# Altium project MU-RK3576J-MB.PrjPCB (part 2 of 13)

## Sheet PWR_PMIC.SchDoc
size 420 x 297 mm; Title1str: Модуль; PageSetup: Record=PageOptions|CenterHorizontal=False|CenterVertical=False|PrintScale=0.95|XCorrection=0.00|YCorrection=0.00|PrintKind=1|BorderSize=5000000|LeftOffset=0|BottomOffset=0|Orientation=1|PaperLength=1000|PaperWidth=1000|Scale=100|PaperSource=15|PrintQuality=600|MediaType=1|DitherType=10|PaperKind=A4|PrintScaleMode=1; Title2str: ATB-LW-USB-GateWay; Mass: ---; Letter1Column: О; Letter2Column: {L}; DocumentType1str: {Документ}; DocumentType2str: {Документ}; SpravNomer: {Справ. №}; Scale: 1:1; DocumentType: Схема электрическая принципиальная; SheetNumber: 7; SheetTotal: 32; DocumentTypeShort: Э3; DocumentInvertoryNumber: ㅤ
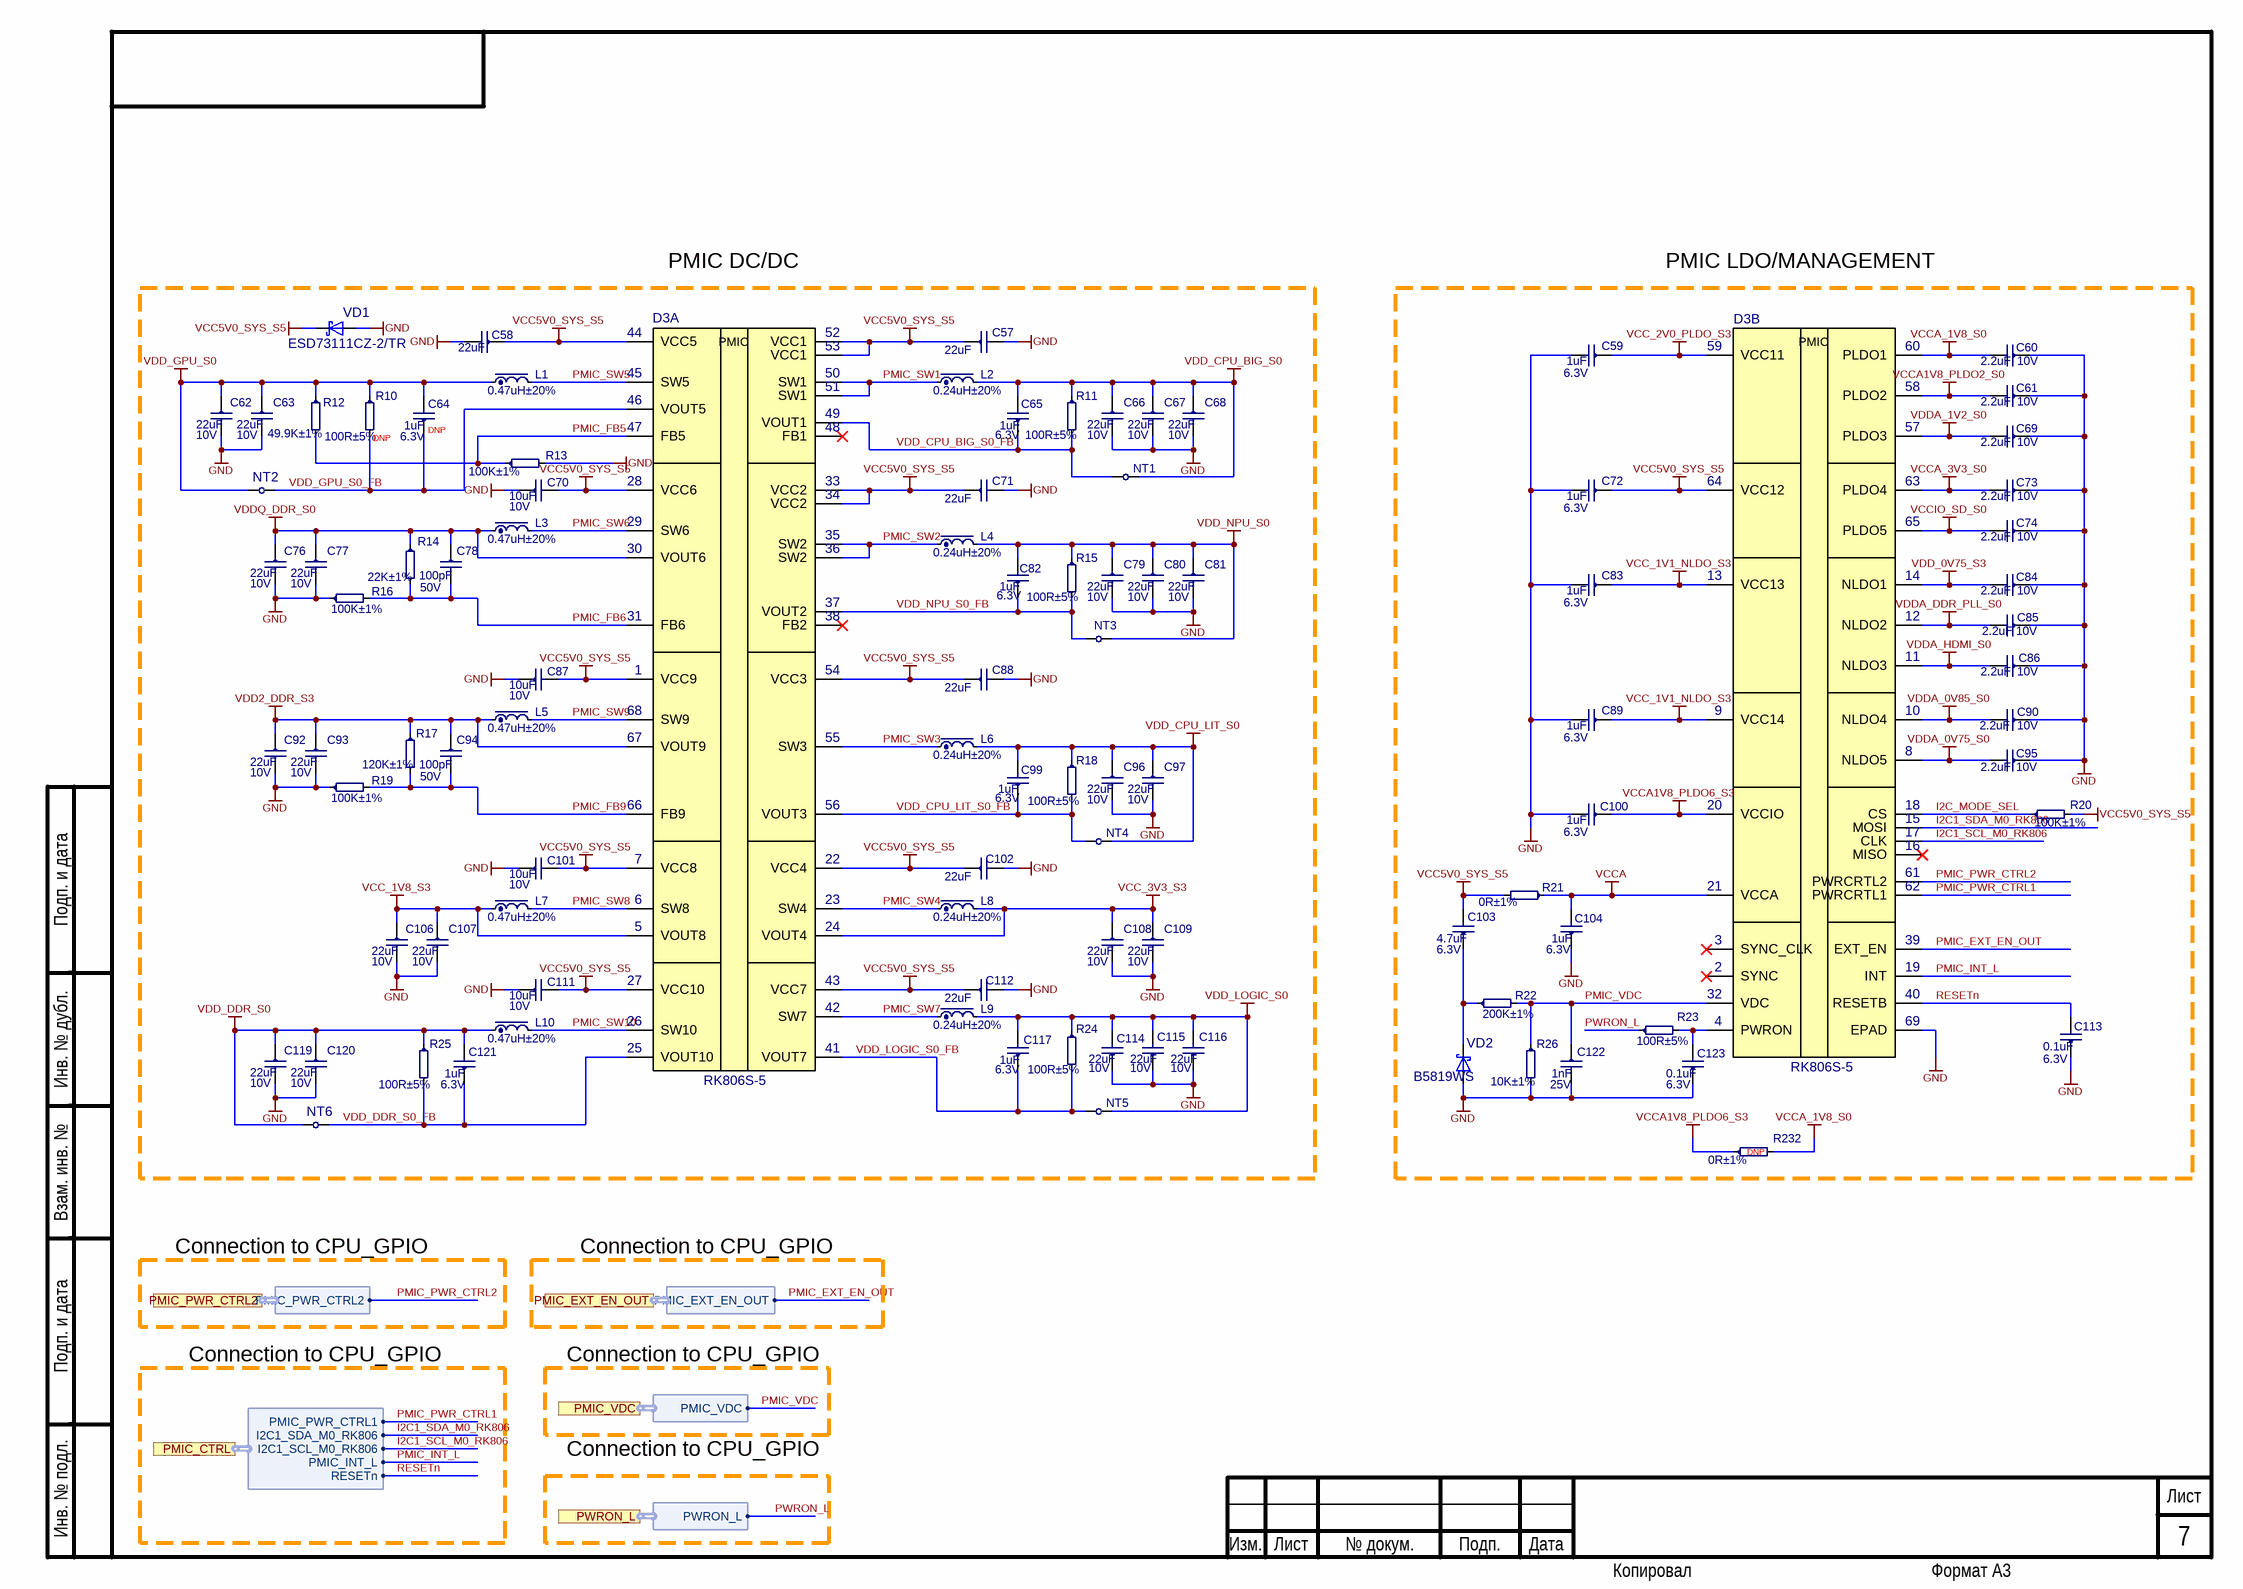
[diagram p4: PWR_PMIC.SchDoc]

### Parts
C57  22uF  [C0603]
C58  22uF  [C0603]
C59  1uF  Voltage: 6.3V  [C0201]
C60  2.2uF  Voltage: 10V  [C0402]
C61  2.2uF  Voltage: 10V  [C0402]
C62  22uF  Voltage: 10V  [C0603]
C63  22uF  Voltage: 10V  [C0603]
C64  1uF  Voltage: 6.3V  [C0201]
C65  1uF  Voltage: 6.3V  [C0201]
C66  22uF  Voltage: 10V  [C0603]
C67  22uF  Voltage: 10V  [C0603]
C68  22uF  Voltage: 10V  [C0603]
C69  2.2uF  Voltage: 10V  [C0402]
C70  10uF  Voltage: 10V  [C0603]
C71  22uF  [C0603]
C72  1uF  Voltage: 6.3V  [C0201]
C73  2.2uF  Voltage: 10V  [C0402]
C74  2.2uF  Voltage: 10V  [C0402]
C76  22uF  Voltage: 10V  [C0603]
C77  22uF  Voltage: 10V  [C0603]
C78  100pF  Voltage: 50V  [C0402]
C79  22uF  Voltage: 10V  [C0603]
C80  22uF  Voltage: 10V  [C0603]
C81  22uF  Voltage: 10V  [C0603]
C82  1uF  Voltage: 6.3V  [C0201]
C83  1uF  Voltage: 6.3V  [C0201]
C84  2.2uF  Voltage: 10V  [C0402]
C85  2.2uF  Voltage: 10V  [C0402]
C86  2.2uF  Voltage: 10V  [C0402]
C87  10uF  Voltage: 10V  [C0603]
C88  22uF  [C0603]
C89  1uF  Voltage: 6.3V  [C0201]
C90  2.2uF  Voltage: 10V  [C0402]
C92  22uF  Voltage: 10V  [C0603]
C93  22uF  Voltage: 10V  [C0603]
C94  100pF  Voltage: 50V  [C0402]
C95  2.2uF  Voltage: 10V  [C0402]
C96  22uF  Voltage: 10V  [C0603]
C97  22uF  Voltage: 10V  [C0603]
C99  1uF  Voltage: 6.3V  [C0201]
C100  1uF  Voltage: 6.3V  [C0201]
C101  10uF  Voltage: 10V  [C0603]
C102  22uF  [C0603]
C103  4.7uF  Voltage: 6.3V  [C0201]
C104  1uF  Voltage: 6.3V  [C0201]
C106  22uF  Voltage: 10V  [C0603]
C107  22uF  Voltage: 10V  [C0603]
C108  22uF  Voltage: 10V  [C0603]
C109  22uF  Voltage: 10V  [C0603]
C111  10uF  Voltage: 10V  [C0603]
C112  22uF  [C0603]
C113  0.1uF  Voltage: 6.3V  [C0201]
C114  22uF  Voltage: 10V  [C0603]
C115  22uF  Voltage: 10V  [C0603]
C116  22uF  Voltage: 10V  [C0603]
C117  1uF  Voltage: 6.3V  [C0201]
C119  22uF  Voltage: 10V  [C0603]
C120  22uF  Voltage: 10V  [C0603]
C121  1uF  Voltage: 6.3V  [C0201]
C122  1nF  Voltage: 25V  [C0201]
C123  0.1uF  Voltage: 6.3V  [C0201]
D3  RK806S-5  [RK806-1]  (parts A,B of 2)
L1  0.47uH±20%  [L0806]
L2  0.24uH±20%  [L0806]
L3  0.47uH±20%  [L0806]
L4  0.24uH±20%  [L0806]
L5  0.47uH±20%  [L0806]
L6  0.24uH±20%  [L0806]
L7  0.47uH±20%  [L0806]
L8  0.24uH±20%  [L0806]
L9  0.24uH±20%  [L0806]
L10  0.47uH±20%  [L0806]
NT1  (no value)  [NetTie_0.6mm_close]  (net tie, no BOM)
NT2  (no value)  [NetTie_0.6mm_close]  (net tie, no BOM)
NT3  (no value)  [NetTie_0.6mm_close]  (net tie, no BOM)
NT4  (no value)  [NetTie_0.6mm_close]  (net tie, no BOM)
NT5  (no value)  [NetTie_0.6mm_close]  (net tie, no BOM)
NT6  (no value)  [NetTie_0.6mm_close]  (net tie, no BOM)
R10  100R±5%  [R0201]
R11  100R±5%  [R0201]
R12  49.9K±1%  [R0402]
R13  100K±1%  [R0402]
R14  22K±1%  [R0402]
R15  100R±5%  [R0201]
R16  100K±1%  [R0402]
R17  120K±1%  [R0402]
R18  100R±5%  [R0201]
R19  100K±1%  [R0402]
R20  100K±1%  [R0201]
R21  0R±1%  [R0402]
R22  200K±1%  [R0201]
R23  100R±5%  [R0201]
R24  100R±5%  [R0201]
R25  100R±5%  [R0201]
R26  10K±1%  [R0201]
R232  0R±1%  [R0402]
VD1  ESD73111CZ-2/TR  [ESD73111CZ-2/TR]
VD2  B5819WS  [B5819WS]

### Ports
PMIC_CTRL (harness PMIC_CTRL), PMIC_EXT_EN_OUT (harness PMIC_EXT_EN_OUT), PMIC_PWR_CTRL2 (harness PMIC_PWR_CTRL2), PMIC_VDC (harness PMIC_VDC), PWRON_L (harness PWRON_L)

### Harnesses
PMIC_CTRL: I2C1_SDA_M0_RK806, I2C1_SCL_M0_RK806, PMIC_PWR_CTRL1, PMIC_INT_L, RESETn
PWRON_L: PWRON_L
PMIC_VDC: PMIC_VDC
PMIC_PWR_CTRL2: PMIC_PWR_CTRL2
PMIC_EXT_EN_OUT: PMIC_EXT_EN_OUT

### Nets
GND: C57.2 C58.2 C59.2 C60.1 C61.1 C62.2 C63.2 C66.2 C67.2 C68.2 C69.1 C70.1 C71.2 C72.2 C73.1 C74.1 C76.2 C77.2 C79.2 C80.2 C81.2 C83.2 C84.1 C85.1 C86.1 C87.1 C88.2 C89.2 C90.1 C92.2 C93.2 C95.1 C96.2 C97.2 C100.2 C101.1 C102.2 C104.1 C106.2 C107.2 C108.2 C109.2 C111.1 C112.2 C113.1 C114.1 C115.1 C116.1 C119.2 C120.2 C122.2 C123.1 D3.69(EPAD) R13.2 R16.1 R19.1 R26.2 VD1.2(A) VD2.2(A)
VCC5V0_SYS_S5: C57.1 C58.1 C70.2 C71.1 C72.1 C87.2 C88.1 C101.2 C102.1 C103.2 C111.2 C112.1 D3.1(VCC9) D3.7(VCC8) D3.22(VCC4) D3.27(VCC10) D3.28(VCC6) D3.33(VCC2) D3.34(VCC2) D3.43(VCC7) D3.44(VCC5) D3.52(VCC1) D3.53(VCC1) D3.54(VCC3) D3.64(VCC12) R20.2 R21.2 VD1.1(K)
VCC_1V1_NLDO_S3: C83.1 C89.1 D3.9(VCC14) D3.13(VCC13)
VCC_1V8_S3: C106.1 C107.1 D3.5(VOUT8) L7.1
VCC_2V0_PLDO_S3: C59.1 D3.59(VCC11)
VCC_3V3_S3: C108.1 C109.1 D3.24(VOUT4) L8.2
VCCA: C104.2 D3.21(VCCA) R21.1
VCCA1V8_PLDO2_S0: C61.2 D3.58(PLDO2)
VCCA1V8_PLDO6_S3: C100.1 D3.20(VCCIO) R232.1
VCCA_1V8_S0: C60.2 D3.60(PLDO1) R232.2
VCCA_3V3_S0: C73.2 D3.63(PLDO4)
VCCIO_SD_S0: C74.2 D3.65(PLDO5)
VDD2_DDR_S3: C92.1 C93.1 C94.1 D3.67(VOUT9) L5.1 R17.1
VDD_0V75_S3: C84.2 D3.14(NLDO1)
VDD_CPU_BIG_S0: C65.2 C66.1 C67.1 C68.1 L2.2 NT1.2 R11.1
VDD_CPU_LIT_S0: C96.1 C97.1 C99.2 L6.2 NT4.2 R18.1
VDD_DDR_S0: C119.1 C120.1 C121.2 L10.1 NT6.1 R25.1
VDD_GPU_S0: C62.1 C63.1 C64.2 L1.1 NT2.1 R10.1 R12.1
VDD_LOGIC_S0: C114.2 C115.2 C116.2 C117.2 L9.2 NT5.2 R24.1
VDD_NPU_S0: C79.1 C80.1 C81.1 C82.2 L4.2 NT3.2 R15.1
VDDA_0V75_S0: C95.2 D3.8(NLDO5)
VDDA_0V85_S0: C90.2 D3.10(NLDO4)
VDDA_1V2_S0: C69.2 D3.57(PLDO3)
VDDA_DDR_PLL_S0: C85.2 D3.12(NLDO2)
VDDA_HDMI_S0: C86.2 D3.11(NLDO3)
VDDQ_DDR_S0: C76.1 C77.1 C78.1 D3.30(VOUT6) L3.1 R14.1
I2C1_SCL_M0_RK806: D3.17(CLK) ; port PMIC_CTRL.I2C1_SCL_M0_RK806
I2C1_SDA_M0_RK806: D3.15(MOSI) ; port PMIC_CTRL.I2C1_SDA_M0_RK806
I2C_MODE_SEL: D3.18(CS) R20.1
PMIC_EXT_EN_OUT: D3.39(EXT_EN) ; port PMIC_EXT_EN_OUT.PMIC_EXT_EN_OUT
PMIC_FB5: D3.47(FB5) R12.2 R13.1
PMIC_FB6: C78.2 D3.31(FB6) R14.2 R16.2
PMIC_FB9: C94.2 D3.66(FB9) R17.2 R19.2
PMIC_INT_L: D3.19(INT) ; port PMIC_CTRL.PMIC_INT_L  [project net PMIC_CTRL.PMIC_INT_L]
PMIC_PWR_CTRL1: D3.62(PWRCRTL1) ; port PMIC_CTRL.PMIC_PWR_CTRL1  [project net PMIC_CTRL.PMIC_PWR_CTRL1]
PMIC_PWR_CTRL2: D3.61(PWRCRTL2) ; port PMIC_PWR_CTRL2.PMIC_PWR_CTRL2
PMIC_SW1: D3.50(SW1) D3.51(SW1) L2.1
PMIC_SW2: D3.35(SW2) D3.36(SW2) L4.1
PMIC_SW3: D3.55(SW3) L6.1
PMIC_SW4: D3.23(SW4) L8.1
PMIC_SW5: D3.45(SW5) L1.2
PMIC_SW6: D3.29(SW6) L3.2
PMIC_SW7: D3.42(SW7) L9.1
PMIC_SW8: D3.6(SW8) L7.2
PMIC_SW9: D3.68(SW9) L5.2
PMIC_SW10: D3.26(SW10) L10.2
PMIC_VDC: C122.1 D3.32(VDC) R22.2 R26.1 ; port PMIC_VDC.PMIC_VDC
PWRON_L: R23.1 ; port PWRON_L.PWRON_L
RESETn: C113.2 D3.40(RESETB) ; port PMIC_CTRL.RESETn  [project net PMIC_CTRL.RESETn]
VDD_CPU_BIG_S0_FB: C65.1 D3.49(VOUT1) NT1.1 R11.2
VDD_CPU_LIT_S0_FB: C99.1 D3.56(VOUT3) NT4.1 R18.2
VDD_DDR_S0_FB: C121.1 D3.25(VOUT10) NT6.2 R25.2
VDD_GPU_S0_FB: C64.1 D3.46(VOUT5) NT2.2 R10.2
VDD_LOGIC_S0_FB: C117.1 D3.41(VOUT7) NT5.1 R24.2
VDD_NPU_S0_FB: C82.1 D3.37(VOUT2) NT3.1 R15.2
NetC103_1: C103.1 R22.1 VD2.1(K)
NetC123_2: C123.2 D3.4(PWRON) R23.2

Not connected (* = marked no-connect by the designer): D3 2(SYNC)* 3(SYNC_CLK)* 16(MISO)* 38(FB2)* 48(FB1)*

### Notes on the sheet
- PMIC DC/DC
- PMIC LDO/MANAGEMENT
- (near R10) DNP
- (near C64) DNP
- (near R232) DNP
- Connection to CPU_GPIO
- Подп. и дата
- Инв. № дубл.
- Взам. инв. №
- Инв. № подл.
- Изм.
- Лист
- № докум.
- Подп.
- Дата
- Копировал
- Формат А3
- (in symbol RK806S-5, part A) PMIC
- (in symbol RK806S-5, part B) PMIC

### Library data of the parts
C57 C58 C71 C88 C102 C112 = 0603-X5R-10V-22uF±20%: *; Manufacturer: Samsung Electro-Mechanics; NameFromManufacturer: CL10A226MQ8NRNE; Dielectric: X5R; Voltage: 10V; Place: *); Tolerance: 20%; Check: False; Case: C0603; Part Number: 0603-X5R-10V-22uF±20%; Value: 22uF; Temperature: -55°C~85°C; ComponentLink2Description: Link to datasheet; ComponentLink1Description: DATASHEET; ComponentLink2URL: https://www.lcsc.com/product-detail/Multilayer-Ceramic-Capacitors-MLCC-SMD-SMT_Samsung-Electro-Mechanics-CL10A226MQ8NRNE_C159801.html; ComponentLink1URL: Datasheets/capacitors/1810261912_Samsung-Electro-Mechanics-CL10A226MQ8NRNE_C159801.pdf#Datasheets/capacitors/1810261912_Samsung-Electro-Mechanics-CL10A226MQ8NRNE_C159801.pdf#; Last changed: 05.12.2022
C59 C64 C65 C72 C82 C83 C89 C99 C100 C104 C117 C121 = 0201-X5R-6.3V-1uF±20%: Manufacturer: Murata Electronics; NameFromManufacturer: GRM033R60J105MEA2D; Dielectric: X5R; Place: *); Tolerance: 20%; Check: False; Case: C0201; Part Number: 0201-X5R-6.3V-1uF±20%; Value: 1uF; Temperature: -55°C~85°C; ComponentLink2Description: Link to datasheet; ComponentLink1Description: DATASHEET; ComponentLink2URL: https://www.terraelectronica.ru/product/1209278; ComponentLink1URL: Datasheets/capacitors/GRM033R60J105MEA2-61A.pdf; Last changed: 27.10.2022
C60 C61 C69 C73 C74 C84-C86 C90 C95 = 0402-X5R-10V-2.2uF±10%: *; Manufacturer: Yageo; NameFromManufacturer: CC0402KRX5R6BB225; Dielectric: X5R; Place: *); Tolerance: 10%; Check: False; Case: C0402; Part Number: 0402-X5R-10V-2.2uF±10%; Value: 2.2uF; Temperature: -55°C~85°C; ComponentLink2Description: Link to datasheet; ComponentLink1Description: DATASHEET; ComponentLink2URL: https://ru.mouser.com/ProductDetail/YAGEO/CC0402KRX5R6BB225?qs=%2Fha2pyFadujgDGyIaqGI8bfvbfiNNcC7p03y2QorR%252BZcRhliH8dUqw%3D%3D; ComponentLink1URL: Datasheets/capacitors/UPY-GPHC_X5R_4V-to-50V_27.pdf; Last changed: 27.10.2022
C62 C63 C66-C68 C76 C77 C79-C81 C92 C93 C96 C97 C106-C109 C114-C116 C119 C120 = 0603-X5R-10V-22uF±20%: *; Manufacturer: Samsung Electro-Mechanics; NameFromManufacturer: CL10A226MQ8NRNE; Dielectric: X5R; Place: *); Tolerance: 20%; Check: False; Case: C0603; Part Number: 0603-X5R-10V-22uF±20%; Value: 22uF; Temperature: -55°C~85°C; ComponentLink2Description: Link to datasheet; ComponentLink1Description: DATASHEET; ComponentLink2URL: https://www.lcsc.com/product-detail/Multilayer-Ceramic-Capacitors-MLCC-SMD-SMT_Samsung-Electro-Mechanics-CL10A226MQ8NRNE_C159801.html; ComponentLink1URL: Datasheets/capacitors/1810261912_Samsung-Electro-Mechanics-CL10A226MQ8NRNE_C159801.pdf#Datasheets/capacitors/1810261912_Samsung-Electro-Mechanics-CL10A226MQ8NRNE_C159801.pdf#; Last changed: 05.12.2022
C70 C87 C101 C111 = 0603-X5R-10V-10uF±10%: *; Manufacturer: Yageo; NameFromManufacturer: CC0603KRX5R6BB106; Dielectric: X5R; Place: *); Tolerance: 10%; Check: False; Case: C0603; Part Number: 0603-X5R-10V-10uF±10%; Value: 10uF; Temperature: -55°C~85°C; ComponentLink2Description: Link to datasheet; ComponentLink1Description: DATASHEET; ComponentLink2URL: https://www.yageo.com/upload/media/product/productsearch/datasheet/mlcc/UPY-GPHC_X5R_4V-to-50V_26.pdf; ComponentLink1URL: Datasheets/capacitors/UPY-GPHC_X5R_4V-to-50V_26.pdf; Last changed: 27.10.2022
C78 C94 = 0402-NP0-50V-100pF±1%: Manufacturer: Yageo; NameFromManufacturer: CC0402FRNPO9BN101; Dielectric: NP0; Place: *); Tolerance: 1%; Check: False; Case: C0402; Part Number: 0402-NP0-50V-100pF±1%; Value: 100pF; Temperature: -55°C~125°C; ComponentLink2Description: Link to datasheet; ComponentLink1Description: DATASHEET; ComponentLink2URL: https://www.yageo.com/upload/media/product/productsearch/datasheet/mlcc/UPY-GP_NP0_16V-to-50V_18.pdf; ComponentLink1URL: Datasheets/capacitors/UPY-GP_NP0_16V-to-50V_18.pdf; Last changed: 27.10.2022
C103 = 0201-X5R-6.3V-4.7uF±20%: Manufacturer: Murata Electronics; NameFromManufacturer: GRM035R60J475ME15D; Dielectric: X5R; Place: *); Tolerance: 20%; Check: False; Case: C0201; Part Number: 0201-X5R-6.3V-4.7uF±20%; Value: 4.7uF; Temperature: -55°C~85°C; ComponentLink2Description: Link to datasheet; ComponentLink1Description: DATASHEET; ComponentLink2URL: https://www.terraelectronica.ru/product/2272938; ComponentLink1URL: Datasheets/capacitors/GRM035R60J475ME15-01A.pdf; Last changed: 27.10.2022
C113 C123 = 0201-X5R-6.3V-0.1uF±10%: Manufacturer: Yageo; NameFromManufacturer: CC0201KRX5R5BB104; Dielectric: X5R; Place: *); Tolerance: 10%; Check: False; Case: C0201; Part Number: 0201-X5R-6.3V-0.1uF±10%; Value: 0.1uF; Temperature: -55°C~85°C; ComponentLink2Description: Link to datasheet; ComponentLink1Description: DATASHEET; ComponentLink2URL: https://www.terraelectronica.ru/product/1020032; ComponentLink1URL: Datasheets/capacitors/UPY-GPHC_X5R_4V-to-50V_27.pdf; Last changed: 27.10.2022
C122 = 0201-C0G-25V-100pF±5%: *; Part Number: 0201-C0G-25V-1nF±5%; Manufacturer: muRata; NameFromManufacturer: GRM0335C1E102JA01D; Dielectric: C0G; Place: *); Tolerance: 5%; Check: False; Case: C0201; Value: 1nF; Temperature: -55°C~125°C; ComponentLink2Description: Link to datasheet; ComponentLink1Description: DATASHEET; ComponentLink2URL: https://ru.mouser.com/ProductDetail/YAGEO/CC0201JRNPO8BN101?qs=%2Fha2pyFaduhl6p6a7Jtfij5kOT7C0BCbN0eDEcSOi5wWtTVDmUsGTw%3D%3D; ComponentLink1URL: Datasheets/capacitors/UPY-GP_NP0_16V-to-50V_18.pdf; Last changed: 27.10.2022
D3 = RK806S-5: Power Management; Manufacturer: Rockchip; Check: False; Part Number: RK806S-5; Value: RK806S-5; NameFromManufacturer: RK806S-5
L1 L3 L5 L7 L10 = 0806-5A-0.47uH±20%: Manufacturer: INPAQ; NameFromManufacturer: WIP201610P-R47ML; Current: 3.15A; Place: *); Value: 0.47uH; Tolerance: 20%; DC Resistance: 0.026R; Check: False; Case: XXXX; Part Number: 0806-5A-0.47uH±20%; Temperature: -55°C~125°C; ComponentLink1Description: DATASHEET; ComponentLink1URL: https://www.terraelectronica.ru/product/3409769; Datasheet: Datasheets/inductors/J(E)TE243A-0006.pdf; Last changed: 27.10.2022
L2 L4 L6 L8 L9 = 0806-5A-0.47uH±20%: Part Number: 0806-4.4A-0.24uH±20%; Manufacturer: cjiang; NameFromManufacturer: FPA201612D-R24MT0; Current: 4.4A; Place: *); Value: 0.24uH; Tolerance: 20%; DC Resistance: 0.026R; Check: False; Case: XXXX; Temperature: -55°C~125°C; ComponentLink1Description: DATASHEET; ComponentLink1URL: https://www.terraelectronica.ru/product/3409769; Datasheet: Datasheets/inductors/J(E)TE243A-0006.pdf; Last changed: 27.10.2022
NT1-NT6 = Перемычка закрытая_0.6мм: Check: False; Part Number: Перемычка закрытая_0.6мм; ComponentLink1Description: DATASHEET; Last changed: 06.05.2021
R10 R11 R15 R18 R23-R25 = 0201-0.05W-100R-200ppm-5%: *; NameFromManufacturer: RC0201JR-07100RL; Manufacturer: Yageo; Place: *); Value: 100R; Tolerance: 5%; Check: False; Case: R0201; Part Number: 0201-0.05W-100R-200ppm-5%; Temperature: -40°C~125°C; ComponentLink1Description: DATASHEET; ComponentLink1URL: https://www.terraelectronica.ru/product/431790; Datasheet: Datasheets/resistors/PYu-RC_Group_51_RoHS_L_11.pdf; Last changed: 27.10.2022
R12 = 0402-0.0625W-49.9K-100ppm±1%: Chip Resistor 0402 49.9kΩ ±1% 50V ±100ppm/℃ Thick Film; NameFromManufacturer: RC0402FR-0749K9L; Manufacturer: Yageo; Place: *); Value: 49.9K; Check: False; Case: R0402; Part Number: 0402-0.0625W-49.9K-100ppm±1%; Tolerance: 1%; Temperature: -55°C~155°C; ComponentLink1Description: DATASHEET; ComponentLink1URL: https://www.terraelectronica.ru/product/562862; Datasheet: Datasheets/resistors/PYu-RC_Group_51_RoHS_L_11.pdf; Last changed: 27.10.2022
R13 R16 R19 = 0402-0.0625W-100K-100ppm±1%: Chip Resistor 0402 100kΩ ±1% 50V ±100ppm/℃ Thick Film; NameFromManufacturer: RC0402FR-07100KL; Manufacturer: Yageo; Place: *); Value: 100K; Check: False; Case: R0402; Part Number: 0402-0.0625W-100K-100ppm±1%; Tolerance: 1%; Temperature: -55°C~155°C; ComponentLink1Description: DATASHEET; ComponentLink1URL: https://www.yageo.com/upload/media/product/productsearch/datasheet/rchip/PYu-RC_Group_51_RoHS_L_11.pdf; Datasheet: Datasheets/resistors/PYu-RC_Group_51_RoHS_L_11.pdf; Last changed: 27.10.2022
R14 = 0402-0.0625W-22K-100ppm±1%: *; NameFromManufacturer: RC0402FR-0722KL; Manufacturer: Yageo; Place: *); Value: 22K; Tolerance: 1%; Check: False; Case: R0402; Part Number: 0402-0.0625W-22K-100ppm±1%; Temperature: -55°C~155°C; ComponentLink1Description: DATASHEET; ComponentLink1URL: https://www.digikey.com/en/products/detail/yageo/RC0402FR-0722KL/726561?s=N4IgTCBcDaIEoGEAMAWJYBicC0SDsYYA0gDIgC6AvkA; Datasheet: Datasheets/resistors/PYu-RC_Group_51_RoHS_L_11.pdf; Last changed: 27.10.2022
R17 = 0402-0.0625W-120K-100ppm±1%: NameFromManufacturer: RC0402FR-07120KL; Manufacturer: Yageo; Place: *); Value: 120K; Tolerance: 1%; Check: False; Case: R0402; Part Number: 0402-0.0625W-120K-100ppm±1%; Temperature: -55°C~155°C; ComponentLink1Description: DATASHEET; ComponentLink1URL: https://eu.mouser.com/ProductDetail/YAGEO/RC0402FR-07120KL?qs=sxZXDnvRBEiD8SsZ%252BM9D1g%3D%3D; Datasheet: Datasheets/resistors/PYu-RC_Group_51_RoHS_L_11.pdf; Last changed: 27.10.2022
R20 = 0201-0.05W-0R-100ppm-5%: *; Part Number: 0201-0.05W-100K-5%; NameFromManufacturer: RC0201FR-07100KL; Manufacturer: Yageo; Place: *); Value: 100K; Tolerance: 1%; Check: False; Case: R0201; Temperature: -40°C~125°C; ComponentLink1Description: DATASHEET; ComponentLink1URL: https://www.digikey.com/en/products/detail/yageo/RC0201JR-070RL/1948898; Datasheet: Datasheets/resistors/PYu-RC_Group_51_RoHS_L_11.pdf+BB3:B271; Last changed: 27.10.2022
R21 R232 = 0402-0.0625W-0R-100ppm±1%: as R52 on sheet PWR_MAIN; Case: R0402; Part Number: 0402-0.0625W-0R-100ppm±1%; Tolerance: 1%; Temperature: -55°C~155°C; ComponentLink1Description: DATASHEET; ComponentLink1URL: https://www.chipdip.ru/product0/8000617426?ysclid=l7og5x0plo427794326; Datasheet: Datasheets/resistors/DOC012445956.pdf; Last changed: 27.10.2022
R22 = 0201-0.05W-0R-100ppm-5%: *; Part Number: 0201-0.05W-200K-100ppm-1%; NameFromManufacturer: RC0201FR-07200KL; Manufacturer: Yageo; Place: *); Value: 200K; Tolerance: 1%; Check: False; Case: R0201; Temperature: -40°C~125°C; ComponentLink1Description: DATASHEET; ComponentLink1URL: https://www.digikey.com/en/products/detail/yageo/RC0201JR-070RL/1948898; Datasheet: Datasheets/resistors/PYu-RC_Group_51_RoHS_L_11.pdf+BB3:B271; Last changed: 27.10.2022
R26 = 0201-0.05W-0R-100ppm-5%: *; Part Number: 0201-0.05W-10K-100ppm-1%; NameFromManufacturer: RC0201FR-0710KL; Manufacturer: Yageo; Place: *); Value: 10K; Tolerance: 1%; Check: False; Case: R0201; Temperature: -40°C~125°C; ComponentLink1Description: DATASHEET; ComponentLink1URL: https://www.digikey.com/en/products/detail/yageo/RC0201JR-070RL/1948898; Datasheet: Datasheets/resistors/PYu-RC_Group_51_RoHS_L_11.pdf+BB3:B271; Last changed: 27.10.2022
VD1 = ESD73111CZ-2/TR: 6.5VC Clamp 6A@8/20us Ipp ESD DIODE DWN0603-2L; Manufacturer: WILLSEMI; Check: False; Part Number: ESD73111CZ-2/TR; Value: ESD73111CZ-2/TR; NameFromManufacturer: ESD73111CZ-2/TR
VD2 = B5819WS: Rectifier Diode, Schottky, 1 Phase, 1 Element, 1A, 40V V(RRM), Silicon; Check: False; Part Number: B5819WS; Value: B5819WS; NameFromManufacturer: B5819WS